# Altium schematic sheet CH32H417MEU6-UHSIF-Bottom-R0.SchDoc
size 393 x 203 mm; SheetNumber: 1; SheetTotal: 1
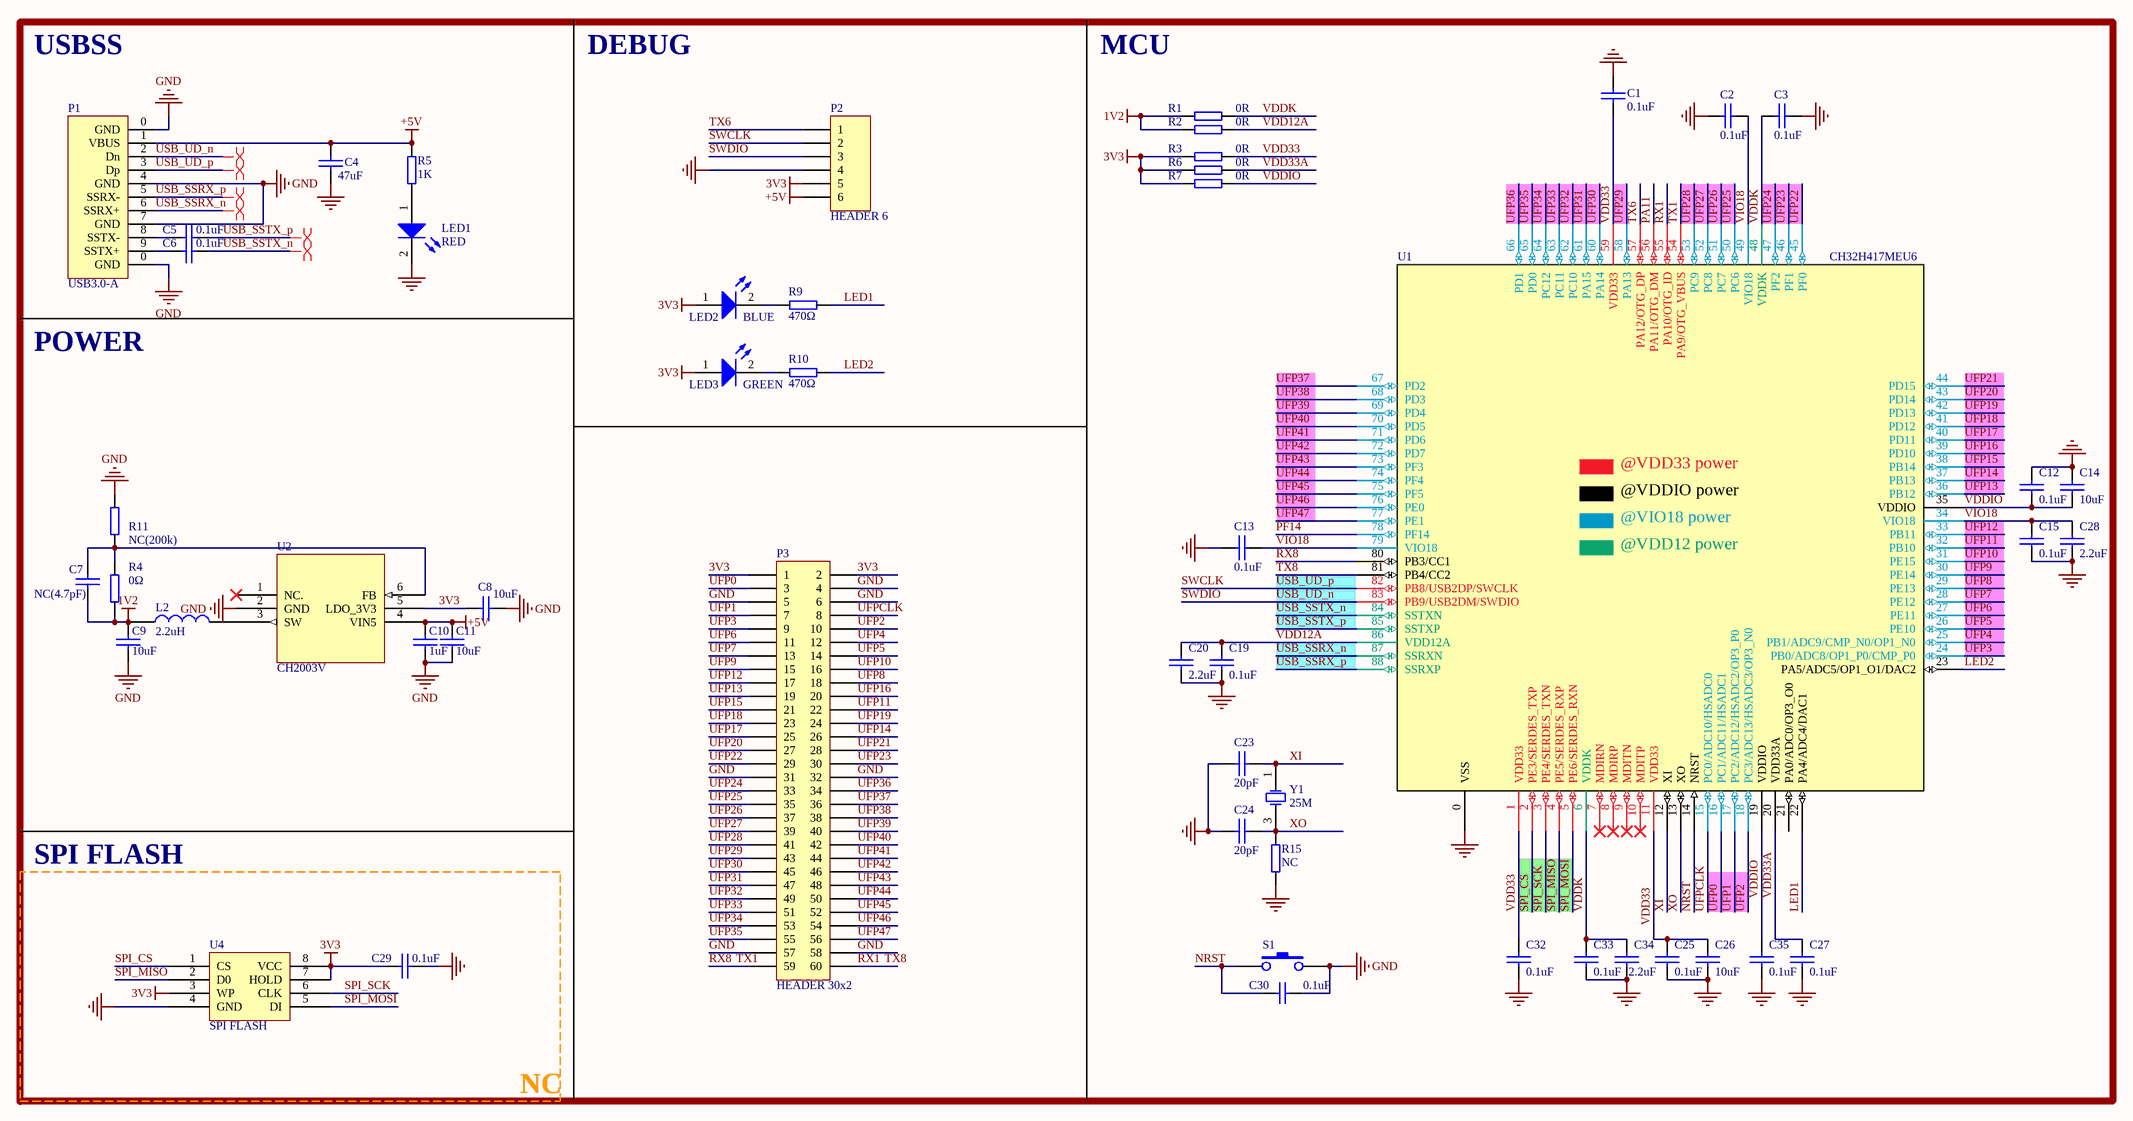
[diagram p0: CH32H417MEU6-UHSIF-Bottom-R0.SchDoc]

## Parts
C1  0.1uF  [0402_C]
C2  0.1uF  [0402_C]
C3  0.1uF  [0402_C]
C4  47uF  [3528_C]
C5  0.1uF  [0402_C]
C6  0.1uF  [0402_C]
C7  NC(4.7pF)  [0402_C]
C8  10uF  [0603_C]
C9  10uF  [0603_C]
C10  1uF  [0402_C]
C11  10uF  [0603_C]
C12  0.1uF  [0402_C]
C13  0.1uF  [0402_C]
C14  10uF  [0402_C]
C15  0.1uF  [0402_C]
C19  0.1uF  [0402_C]
C20  2.2uF  [0402_C]
C23  20pF  [0402_C]
C24  20pF  [0402_C]
C25  0.1uF  [0402_C]
C26  10uF  [0402_C]
C27  0.1uF  [0402_C]
C28  2.2uF  [0402_C]
C29  0.1uF  [0402_C]
C30  0.1uF  [0402_C]
C32  0.1uF  [0402_C]
C33  0.1uF  [0402_C]
C34  2.2uF  [0402_C]
C35  0.1uF  [0402_C]
L2  2.2uH  [CD32]
LED1  RED  [0603+]
LED2  BLUE  [0603+]
LED3  GREEN  [0603+]
P1  USB3.0-A  [USB3.0-A-Receptacle]
P2  HEADER 6  [SIP6-2.54mm]
P3  HEADER 30x2  [BTB-60P-P0.5-MR]
R1  0R  [0603]
R2  0R  [0603]
R3  0R  [0603]
R4  0Ω  [0402]
R5  1K  [0402]
R6  0R  [0603]
R7  0R  [0603]
R9  470Ω  [0402]
R10  470Ω  [0402]
R11  NC(200k)  [0402]
R15  NC  [0402]
S1  (no value)  [贴片按键]
U1  CH32H417MEU6  [QFN88_10X10]
U2  CH2003V  [SOT-23-6]
U4  SPI FLASH  [SOIC-8_208mil]
Y1  25M  [XT3225]

## Nets
1V2: C7.1 C9.2 L2.2 R1.2 R2.2 R4.1
3V3: C8.2 C29.2 LED2.1(A) LED3.1(A) P2.5 P3.1 P3.2 R3.2 R6.2 R7.2 U2.5(LDO_3V3) U4.3(WP) U4.7(HOLD) U4.8(VCC)
+5V: C4.1 C10.2 C11.2 P1.1(VBUS) P2.6 R5.2 U2.4(VIN5)
GND: C1.2 C2.2 C3.1 C4.2 C8.1 C9.1 C10.1 C11.1 C12.2 C13.2 C14.2 C15.1 C19.1 C20.1 C23.1 C24.1 C25.1 C26.1 C27.1 C28.1 C29.1 C30.1 C32.1 C33.1 C34.1 C35.1 LED1.2(K) P1.0(GND) P1.4(GND) P1.7(GND) P2.4 P3.4 P3.5 P3.6 P3.31 P3.32 P3.57 P3.58 R11.2 R15.1 S1.2 U1.0(VSS) U2.2(GND) U4.4(GND)
LED1: R9.1 U1.22(PA4/ADC4/DAC1)
LED2: R10.1 U1.23(PA5/ADC5/OP1_O1/DAC2)
NRST: C30.2 S1.1 U1.14(NRST)
PA11: U1.56(PA11/OTG_DM)
PF14: U1.78(PF14)
RX1: P3.60 U1.55(PA10/OTG_ID) U1.81(PB4/CC2)  [also labelled TX8]
RX8: P3.59 U1.54(PA9/OTG_VBUS) U1.80(PB3/CC1)  [also labelled TX1]
SPI_CS: U1.2(PE3/SERDES_TXP) U4.1(CS)
SPI_MISO: U1.4(PE5/SERDES_RXP) U4.2(D0)
SPI_MOSI: U1.5(PE6/SERDES_RXN) U4.5(DI)
SPI_SCK: U1.3(PE4/SERDES_TXN) U4.6(CLK)
SWCLK: P1.3(Dp) P2.2 U1.82(PB8/USB2DP/SWCLK)  [also labelled USB_UD_p]
SWDIO: P1.2(Dn) P2.3 U1.83(PB9/USB2DM/SWDIO)  [also labelled USB_UD_n]
TX6: P2.1 U1.57(PA12/OTG_DP)
UFP0: P3.3 U1.16(PC1/ADC11/HSADC1)
UFP1: P3.7 U1.17(PC2/ADC12/HSADC2/OP3_P0)
UFP2: P3.10 U1.18(PC3/ADC13/HSADC3/OP3_N0)
UFP3: P3.9 U1.24(PB0/ADC8/OP1_P0/CMP_P0)
UFP4: P3.12 U1.25(PB1/ADC9/CMP_N0/OP1_N0)
UFP5: P3.14 U1.26(PE10)
UFP6: P3.11 U1.27(PE11)
UFP7: P3.13 U1.28(PE12)
UFP8: P3.18 U1.29(PE13)
UFP9: P3.15 U1.30(PE14)
UFP10: P3.16 U1.31(PE15)
UFP11: P3.22 U1.32(PB10)
UFP12: P3.17 U1.33(PB11)
UFP13: P3.19 U1.36(PB12)
UFP14: P3.26 U1.37(PB13)
UFP15: P3.21 U1.38(PB14)
UFP16: P3.20 U1.39(PD10)
UFP17: P3.25 U1.40(PD11)
UFP18: P3.23 U1.41(PD12)
UFP19: P3.24 U1.42(PD13)
UFP20: P3.27 U1.43(PD14)
UFP21: P3.28 U1.44(PD15)
UFP22: P3.29 U1.45(PF0)
UFP23: P3.30 U1.46(PF1)
UFP24: P3.33 U1.47(PF2)
UFP25: P3.35 U1.50(PC6)
UFP26: P3.37 U1.51(PC7)
UFP27: P3.39 U1.52(PC8)
UFP28: P3.41 U1.53(PC9)
UFP29: P3.43 U1.58(PA13)
UFP30: P3.45 U1.60(PA14)
UFP31: P3.47 U1.61(PA15)
UFP32: P3.49 U1.62(PC10)
UFP33: P3.51 U1.63(PC11)
UFP34: P3.53 U1.64(PC12)
UFP35: P3.55 U1.65(PD0)
UFP36: P3.34 U1.66(PD1)
UFP37: P3.36 U1.67(PD2)
UFP38: P3.38 U1.68(PD3)
UFP39: P3.40 U1.69(PD4)
UFP40: P3.42 U1.70(PD5)
UFP41: P3.44 U1.71(PD6)
UFP42: P3.46 U1.72(PD7)
UFP43: P3.48 U1.73(PF3)
UFP44: P3.50 U1.74(PF4)
UFP45: P3.52 U1.75(PF5)
UFP46: P3.54 U1.76(PE0)
UFP47: P3.56 U1.77(PE1)
UFPCLK: P3.8 U1.15(PC0/ADC10/HSADC0)
USB_SSRX_n: P1.6(SSRX+) U1.87(SSRXN)
USB_SSRX_p: P1.5(SSRX-) U1.88(SSRXP)
USB_SSTX_n: C6.1 U1.84(SSTXN)
USB_SSTX_p: C5.1 U1.85(SSTXP)
VDD12A: C19.2 C20.2 R2.1 U1.86(VDD12A)
VDD33: C1.1 C25.2 C26.2 C32.2 R3.1 U1.1(VDD33) U1.11(VDD33) U1.59(VDD33)
VDD33A: C27.2 R6.1 U1.20(VDD33A)
VDDIO: C12.1 C14.1 C35.2 R7.1 U1.19(VDDIO) U1.35(VDDIO)
VDDK: C3.2 C33.2 C34.2 R1.1 U1.6(VDDK) U1.48(VDDK)
VIO18: C2.1 C13.1 C15.2 C28.2 U1.34(VIO18) U1.49(VIO18) U1.79(VIO18)
XI: C23.2 U1.12(XI) Y1.1(OSC1)
XO: C24.2 R15.2 U1.13(XO) Y1.3(OSC2)
NetC5_2: C5.2 P1.8(SSTX-)
NetC6_2: C6.2 P1.9(SSTX+)
NetC7_2: C7.2 R4.2 R11.1 U2.6(FB)
NetL2_1: L2.1 U2.3(SW)
NetLED1_1: LED1.1(A) R5.1
NetLED2_2: LED2.2(K) R9.2
NetLED3_2: LED3.2(K) R10.2

Not connected (* = marked no-connect by the designer): U1 7(MDIRN)* 8(MDIRP)* 9(MDITN)* 10(MDITP)* 21(PA0/ADC0/OP3_O0); U2 1(NC.)*

## Layout directives
differential pair: SWCLK, SWDIO, USB_SSRX_n, USB_SSRX_p, USB_SSTX_n, USB_SSTX_p

## Notes on the sheet
- USBSS
- DEBUG
- MCU
- POWER
- SPI FLASH
- NC
- (in symbol CH32H417MEU6) @VDD33 power; @VDDIO power; @VIO18 power; @VDD12 power

## Library data of the parts
C1-C15 C19 C20 C23-C29 C32-C35 = CAP: Capacitor
C30 = Cap: Capacitor
L2 = INDUCTOR
LED1-LED3 = LED: Typical INFRARED GaAs LED
P2 = HEADER 6: Header, 6-Pin
P3 = HEADER 30x2: Header, 30-Pin, Dual row
R1-R7 R9-R11 R15 = RES
S1 = KEY1
U1 = CH32H417MEU6: RISC-V FPU HD-MCU, 384MHz, USB3.0 & PD, 100M Ethernet, DVP, SDMMC, QSPI, OPA, ADC, DAC
U2 = CH2003K: Step-Down DC-DC Converter, 5V input, FB 0.6V, 800mA output, with LDO 3.3V * 200mA
U4 = W25Q64
Y1 = XTAL: Crystal Oscillator; Published: 8-Jun-2000; LatestRevisionDate: 17-Jul-2002; LatestRevisionNote: Re-released for DXP Platform.; PackageReference: R38; Publisher: Altium Limited